# Altium schematic sheet 12V-2A-buck.SchDoc
size A4; SheetNumber: 4; SheetTotal: 8
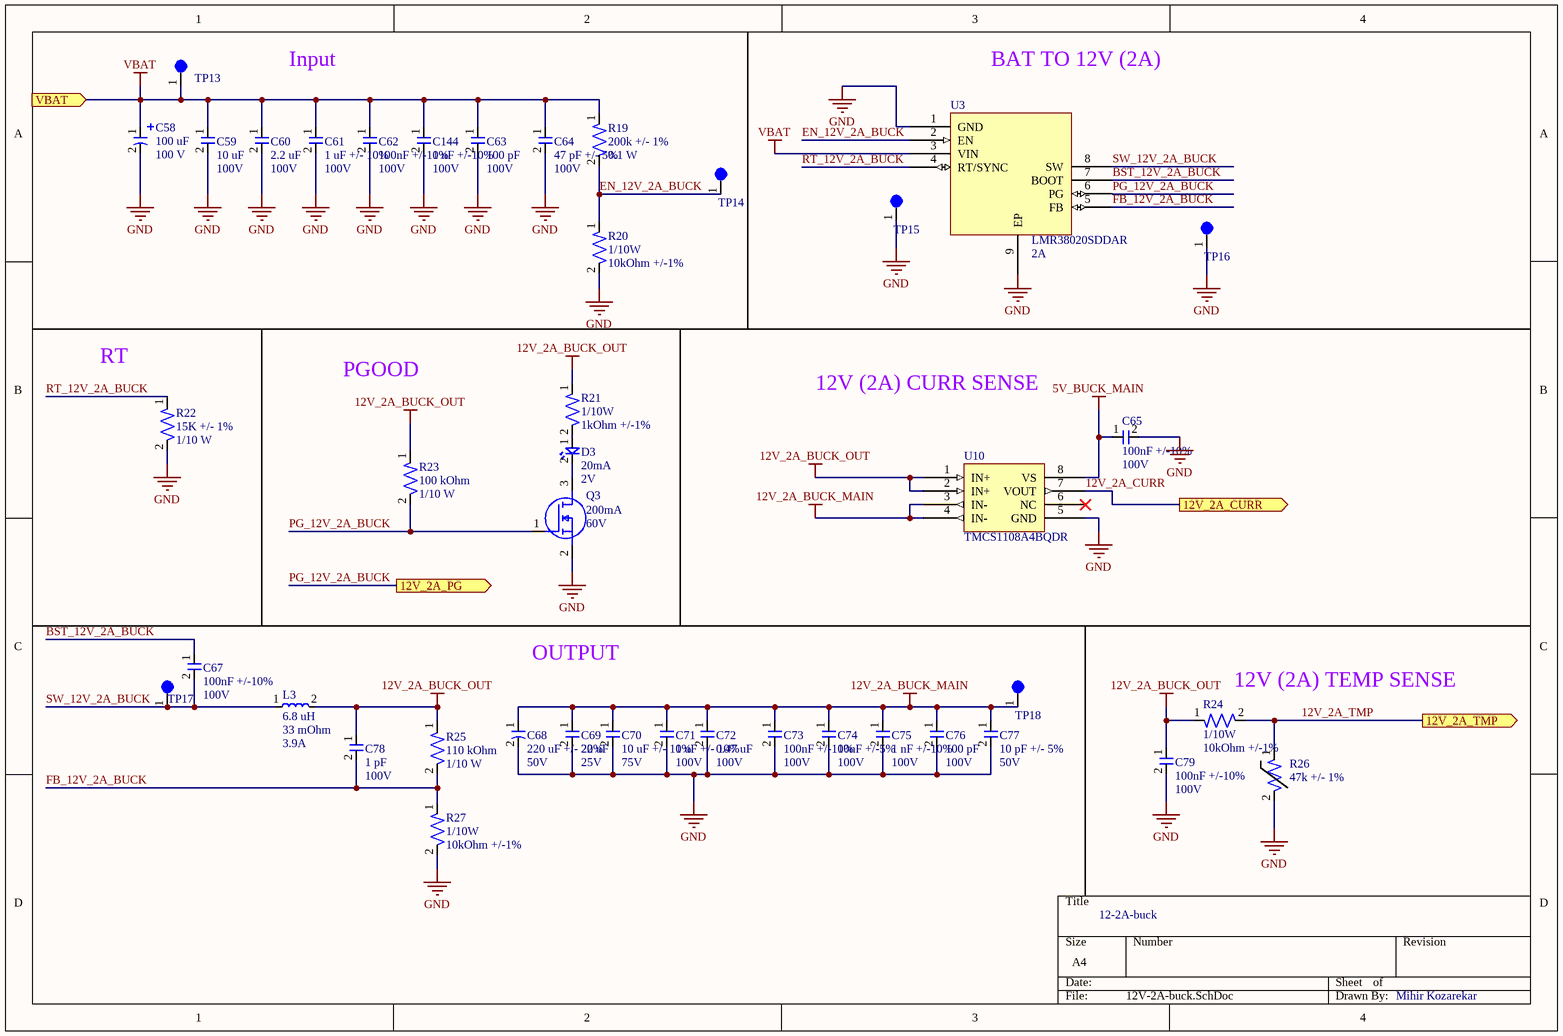
[diagram p0: 12V-2A-buck.SchDoc]

## Parts
C58  Capacitance: 100 uF  Voltage: 100 V  [ELEC-100U-0001]  (hidden comment: 100SEV100M12.5X16)
C59  Capcitance: 10 uF  Voltage Rating: 100V  [CAP-1210]  (hidden comment: GRM32EC72A106KE05L)
C60  Capacitance: 2.2 uF  Voltage: 100V  [CAP-1206]  (hidden comment: CL31B225KCHSNNE)
C61  Capacitance: 1 uF +/- 10%  Voltage: 100V  [CAP-1206 - duplicate]  (hidden comment: CL31B105KCHNNNE)
C62  Capacitance: 100nF +/-10%  Voltage Rating: 100V  [CAP-0603]  (hidden comment: CC0603KRX7R0BB104)
C63  Capacitance: 100 pF  Voltage: 100V  [CAP-0603]  (hidden comment: 0603N101J101CT)
C64  Capacitance: 47 pF +/- 5%  Voltage Rating: 100V  [CAP-0603]  (hidden comment: 7447798111)
C65  Capacitance: 100nF +/-10%  Voltage Rating: 100V  [CAP-0603]  (hidden comment: CC0603KRX7R0BB104)
C67  Capacitance: 100nF +/-10%  Voltage Rating: 100V  [CAP-0603]  (hidden comment: CC0603KRX7R0BB104)
C68  Capacitance: 220 uF +/- 20%  Voltage Rating: 50V  [ELEC-220U-0003]  (hidden comment: 50TZV220M10X10.5)
C69  Capacitance: 22 uF  Voltage: 25V  [CAP-1210]  (hidden comment: CL32B226KAJNNNE)
C70  Capacitance: 10 uF +/- 10%  Voltage Rating: 75V  [CAP-1210]  (hidden comment: C3225X7R1N106K250AC)
C71  Capacitance: 1 uF +/- 10%  Voltage: 100V  [CAP-1206 - duplicate]  (hidden comment: CL31B105KCHNNNE)
C72  Capacitance: 0.47 uF  Voltage: 100V  [CAP-0805]  (hidden comment: KAM21KR72A474KL)
C73  Capacitance: 100nF +/-10%  Voltage Rating: 100V  [CAP-0603]  (hidden comment: CC0603KRX7R0BB104)
C74  Capacitance: 10nF +/-5%  Voltage Rating: 100V  [CAP-0603]  (hidden comment: C1608C0G2A103J080AC)
C75  Capacitance: 1 nF +/-10%  Voltage: 100V  [CAP-0603]  (hidden comment: C0603Y102K1RAC7867)
C76  Capacitance: 100 pF  Voltage: 100V  [CAP-0603]  (hidden comment: 0603N101J101CT)
C77  Capacitance: 10 pF +/- 5%  Voltage Rating: 50V  [CAP-0603]  (hidden comment: 0603N100J500CT)
C78  Capacitance: 1 pF  Voltage: 100V  [CAP-0603]  (hidden comment: 885012006087)
C79  Capacitance: 100nF +/-10%  Voltage Rating: 100V  [CAP-0603]  (hidden comment: CC0603KRX7R0BB104)
C144  Capacitance: 1 nF +/-10%  Voltage: 100V  [CAP-0603]  (hidden comment: C0603Y102K1RAC7867)
D3  Current Rating: 20mA  Vf: 2V  [LED-0603]  (hidden comment: 150060AS75000)
L3  Inductance: 6.8 uH  DCR: 33 mOhm  DCI: 3.9A  [PWRIND-6.8U-0001]  (hidden comment: SRN8040-6R8Y)
Q3  Id-Continuous: 200mA  VDS-Max: 60V  [NMOS-SOT23-3]  (hidden comment: T2N7002AK,LM)
R19  Resistance: 200k +/- 1%  Power Rating: 0.1 W  [RES-0603]  (hidden comment: ERJ-3EKF2003V)
R20  Power Rating: 1/10W  Resistance: 10kOhm +/-1%  [RES-0603]  (hidden comment: RC0603FR-0710KP)
R21  Power Rating: 1/10W  Resistance: 1kOhm +/-1%  [RES-0603]  (hidden comment: RT0603FRE131KL)
R22  Res: 15K +/- 1%  Power: 1/10 W  [RES-0402]  (hidden comment: ERJ-2RKF1502X)
R23  Resistance: 100 kOhm  Power: 1/10 W  [RES-0603]  (hidden comment: RC0603FR-07100KL)
R24  Power Rating: 1/10W  Resistance: 10kOhm +/-1%  [RES-0603]  (hidden comment: RC0603FR-0710KP)
R25  Resistance: 110 kOhm  Power: 1/10 W  [RES-0603]  (hidden comment: RC0603FR-07110KL)
R26  Resistance: 47k +/- 1%  [RES-0402]  (hidden comment: TMP6431DECR)
R27  Power Rating: 1/10W  Resistance: 10kOhm +/-1%  [RES-0603]  (hidden comment: RC0603FR-0710KP)
TP13  5003  [TEST-POINT-0001]  (value not drawn)
TP14  5003  [TEST-POINT-0001]  (value not drawn)
TP15  5003  [TEST-POINT-0001]  (value not drawn)
TP16  5003  [TEST-POINT-0001]  (value not drawn)
TP17  5003  [TEST-POINT-0001]  (value not drawn)
TP18  5003  [TEST-POINT-0001]  (value not drawn)
U3  LMR38020SDDAR  Current: 2A  [IC-8PowerSOIC]
U10  TMCS1108A4BQDR  [IC-CURRENT-0001]

## Ports
12V_2A_CURR (out), 12V_2A_PG (out), 12V_2A_TMP (out), VBAT (in)

## Nets
5V_BUCK_MAIN: C65.1 U10.8(VS)
12V_2A_BUCK_MAIN: C68.1 C69.1 C70.1 C71.1 C72.1 C73.1 C74.1 C75.1 C76.1 C77.1 TP18.1 U10.3(IN-) U10.4(IN-)
12V_2A_BUCK_OUT: C78.1 C79.1 L3.2 R21.1 R23.1 R24.1 R25.1 U10.1(IN+) U10.2(IN+)
GND: C58.2 C59.2 C60.2 C61.2 C62.2 C63.2 C64.2 C65.2 C68.2 C69.2 C70.2 C71.2 C72.2 C73.2 C74.2 C75.2 C76.2 C77.2 C79.2 C144.2 Q3.2(S) R20.2 R22.2 R26.2 R27.2 TP15.1 TP16.1 U3.1(GND) U3.9(EP) U10.5(GND)
VBAT: C58.1 C59.1 C60.1 C61.1 C62.1 C63.1 C64.1 C144.1 R19.1 TP13.1 U3.3(VIN) ; port VBAT
12V_2A_CURR: U10.7(VOUT) ; port 12V_2A_CURR
12V_2A_TMP: R24.2 R26.1 ; port 12V_2A_TMP
BST_12V_2A_BUCK: C67.1 U3.7(BOOT)
EN_12V_2A_BUCK: R19.2 R20.1 TP14.1 U3.2(EN)
FB_12V_2A_BUCK: C78.2 R25.2 R27.1 U3.5(FB)
PG_12V_2A_BUCK: Q3.1(G) R23.2 U3.6(PG) ; port 12V_2A_PG
RT_12V_2A_BUCK: R22.1 U3.4(RT/SYNC)
SW_12V_2A_BUCK: C67.2 L3.1 TP17.1 U3.8(SW)
NetD3_1: D3.1 R21.2
NetD3_2: D3.2 Q3.3(D)

Not connected (* = marked no-connect by the designer): U10 6(NC)*

## Notes on the sheet
- Input
- BAT TO 12V (2A)
- RT
- PGOOD
- 12V (2A) CURR SENSE
- OUTPUT
- (near R24) 12V (2A) TEMP SENSE
- 12-2A-buck
- Mihir Kozarekar

## Library data of the parts
C58 = ELEC-100U-0001: 100 µF 100 V Aluminum Electrolytic Capacitors Radial, Can - SMD 2000 Hrs @ 85°C; Manufacturer: Rubycon; Tolerance: +/- 20%; Assembled?: No; ESR: idk check the datasheet i couldnt find it
C59 = CAP-10U-0003: 10 µF ±10% 100V Ceramic Capacitor X7S 1210 (3225 Metric); Package Size: 1210
C60 = CAP-2.2U-0003: 2.2 µF ±10% 100V Ceramic Capacitor X7R 1206 (3216 Metric); Manufacturer: Samsung Electro-Mechanics; Tolerance: +/- 10%; Assembled?: No; Manufacturer Part Number: CL31B225KCHSNNE; Temperature Coefficient: X7R; Package Size: 1206
C61 C71 = CAP-1U-0001: 1 µF ±10% 100V Ceramic Capacitor X7R 1206 (3216 Metric)
C62 C65 C67 C73 C79 = CAP-100N-0001: CAP CER 0.1UF 100V X7R 0603; Manufacturer: YAGEO; Assembled?: no; Manufacturer Part Number: CC0603KRX7R0BB104; Temperature Coefficient: X7R; Package Size: 0603
C63 C76 = CAP-100P-0002: 100 pF ±5% 100V Ceramic Capacitor C0G, NP0 0603 (1608 Metric); Tolerance: +/-5%; Temp Coeff: C0G/NP0; Package Size: 0603
C64 = CAP-47P-0001: 47 pF ±5% 100V Ceramic Capacitor C0G, NP0 0603 (1608 Metric)
C68 = ELEC-220U-0003: 220 µF 50 V Aluminum Electrolytic Capacitors Radial, Can - SMD 2000 Hrs @ 105°C; Size: .406inx.406in*.413in
C69 = CAP-22U-0003: 22 µF ±10% 25V Ceramic Capacitor X7R 1210 (3225 Metric); Tolerance: +/- 10%; Assembled?: No; Temperature Coefficient: X7R; Package Size: 1210
C70 = CAP-10U-0004: 10 µF ±10% 75V Ceramic Capacitor X7R 1210 (3225 Metric)
C72 = CAP-0.47U-0001: 0.47 µF ±10% 100V Ceramic Capacitor X7R 0805 (2012 Metric); Tolerance: +/- 10%; Assembled?: No; Temperature Coefficient: X7R; Package Size: 0805
C74 = CAP-10N-0002: CAP CER 10000PF 100V C0G 0603; Manufacturer: TDK Corporation; Temperature Coefficient: C0G/NP0; Assembled?: no; Manufacturer Part Number: C1608C0G2A103J080AC; Package Size: 0603
C75 C144 = CAP-1N-0001: 1000 pF ±10% 100V Ceramic Capacitor X7R 0603 (1608 Metric)
C77 = CAP-10P-0001: 10 pF ±5% 50V Ceramic Capacitor C0G, NP0 0603 (1608 Metric); Manufacturer: Walshin Technology Corporation; Assembled?: Yes; Manufacturer Part Number: 0603N100J500CT; Temperature Coefficient: C0G, NP0; Package Size: 0603
C78 = CAP-1P-0001: 1 pF ±0.25pF 100V Ceramic Capacitor C0G, NP0 0603 (1608 Metric); Tolerance: +/- 0.25 pF; Temperature Coefficient: C0G/NP0; Assembled?: No; Package Size: 0603
D3 = LED_Amber_0001: CAP CER 0.1UF 100V X7R 0603; Manufacturer: Wurth Electronik; Assembled?: no; Color: Amber; Manufacturer Part Number: 150060AS75000; Package Size: 0603
L3 = PWRIND-6.8U-0001: 6.8 µH Semi-Shielded Drum Core, Wirewound Inductor 3.9 A 33mOhm Max Nonstandard; Isat: 4.2A; Tolerance: 30%; Assembled?: No
Q3 = NMOS-200MA-0001: MOSFET N-CH 60V 200MA SOT23; Manufacturer: Toshiba; FET type: N-Channel; Rds On-Max: 3.9Ohm; Vgs-Max: 20V; Assembled?: no; Manufacturer Part Number: T2N7002AK,LM; Package: SOT-23-3
R19 = RES-200K-0001: 200 kOhms ±1% 0.1W, 1/10W Chip Resistor 0603 (1608 Metric) Automotive AEC-Q200 Thick Film; Manufacturer: Panasonic Electronic Components; Assembled?: Yes; MFP: ERJ-3EKF2003V; Package SIze: 0603
R20 R24 R27 = RES-10K-0002: RES SMD 10K OHM 1% 1/10W 0603; Manufacturer: YAGEO; Assembled?: no; Manufacturer Part Number: RC0603FR-0710KP; Package Size: 0603
R21 = RES-1K-0002: 1 kOhms ±1% 0.1W, 1/10W Chip Resistor 0603 (1608 Metric) Thin Film; Manufacturer: YAGEO; Assembled?: no; Manufacturer Part Number: RT0603FRE131KL; Package Size: 0603
R22 = RES-15K-0001: 15 kOhms ±1% 0.1W, 1/10W Chip Resistor 0402 (1005 Metric) Automotive AEC-Q200 Thick Film
R23 = RES-100K-0003: 100 kOhms ±1% 0.1W, 1/10W Chip Resistor 0603 (1608 Metric) Moisture Resistant Thick Film; Tolerance: +/- 1%; Assembled?: No; Package Size: 0603
R25 = RES-110K-0001: 110 kOhms ±1% 0.1W, 1/10W Chip Resistor 0603 (1608 Metric) Moisture Resistant Thick Film; Tolerance: +/- 1%; Assembled?: No; Package Size: 0603
R26 = THERM-47K-0001: PTC Thermistor 47 kOhms 0402 (1006 Metric); Manufacturer: Texas Instruments; Manufacturer Part Number: TMP6431DECR; Package Size: 0402
TP13-TP18 = TEST-POINT-0001: Oranange PC Test Point, Miniature Phoisphor Bronze Silver Plating Through Hole Mounting Type
U3 = IC-BUCK-0007: Buck Switching Regulator IC Positive Adjustable 1V 1 Output 2A 8-PowerSOIC (0.154", 3.90mm Width); Manufactuer: Texas Instruments; Assembled?: no; Manufacturer Part Number: LMR38020SDDAR; Type: Buck; Package: 8-PowerSOIC
U10 = IC-CURRENT-0004: Current Sensor 1 Channel Hall Effect Bidirectional 8-SOIC (0.154", 3.90mm Width); Assembled?: No; Supply Voltage: 5V; Footprint: 8-SOIC